# EAGLE design Transmitter+Bug-BC547 (EAGLE 7.7.0)
Simple FM Transmitter with Electret Microphone, based on NPN Transistor
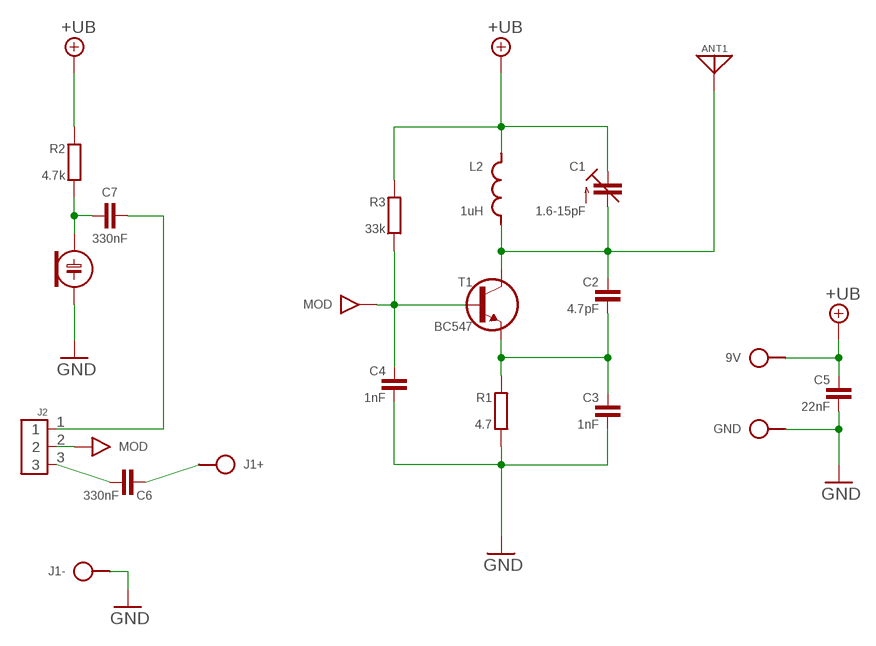
[diagram p0: schematic, sheet 1]

## Parts
9V  SPAD  [SPAD]
ANT1  ANT  [SPAD]
C1  1.6-15pF  C-TR-PH201272222-808-2PINB  [TRIM-2222-808]
C2  4.7pF  C025-015X024  [C025-015X024]
C3  1nF  C025-015X024  [C025-015X024]
C4  1nF  C050-020X036/V  [C050-020X036/V]
C5  22nF  C050-020X036/V  [C050-020X036/V]
C6  330nF  C-H050-020X044  [C050-020X044]
C7  330nF  C050-020X044  [C050-020X044]
ECM  ECM-4  [ECM-4]
GND  SPAD  [SPAD]
J1  SPAD+--+  [SPAD-+]
J2  CONN-3P-3P  [CONN-3P]
L2  1uH  L-SHORT04/7V-X  [L-04/7V-X]
R1  4.7  R0204/2V  [0204/2V]
R2  4.7k  R0202/7-V  [0202/7-V]
R3  33k  R0202/7-V  [0202/7-V]
T1  BC547  BC547CBE  [TO92-CBE]

## Nets
+UB: 9V.1 C1.3(E) C5.1 L2.2 R2.1 R3.1
GND: C3.2 C4.2 C5.2 ECM.2(-) GND.1 J1.1 R1.2
MOD: C4.1 J2.2 R3.2 T1.B
N$1: C6.2 J2.3
N$2: ANT1.1 C1.2(A) C2.1 L2.1 T1.C
N$3: C2.2 C3.1 R1.1 T1.E
N$4: C7.2 J2.1
N$5: C6.1 J1.2
N$6: C7.1 ECM.1(+) R2.2

## Library data of the parts
9V GND = pad:SPAD
ANT1 = pad:ANT
C1 = cap-trim:C-TR-PH20127
C2-C5 C7 = c:C: CAPACITOR, European symbol
C6 = c:C-H
ECM = ECM:ECM
J1 = pad:SPAD+-
J2 = pinconn:CONN-3P
L2 = l:L-SHORT
R1-R3 = r:R: RESISTOR, European symbol
T1 = t:BC547

## Net classes
0 default: width 0.61 mm

## Board
Simple FM Transmitter with Electret Microphone, based on NPN Transistor
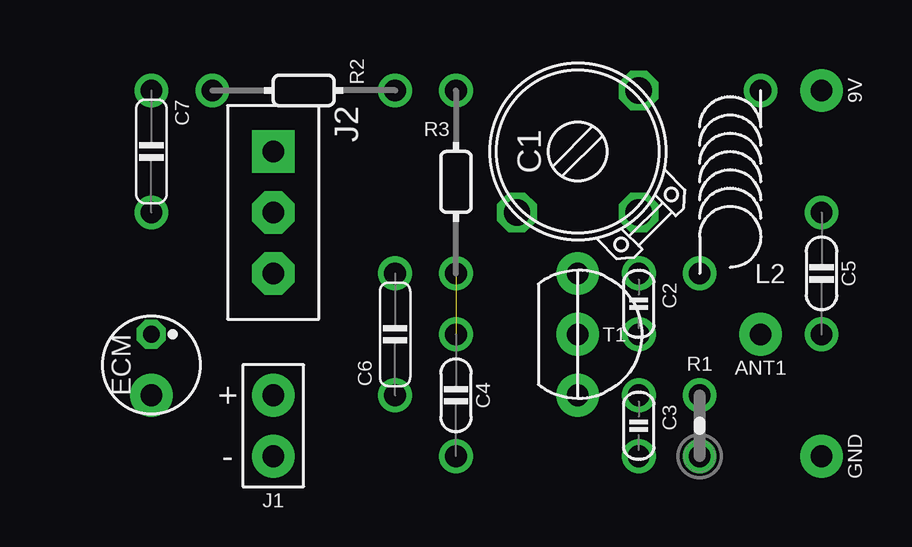
[diagram p1: board, top side]
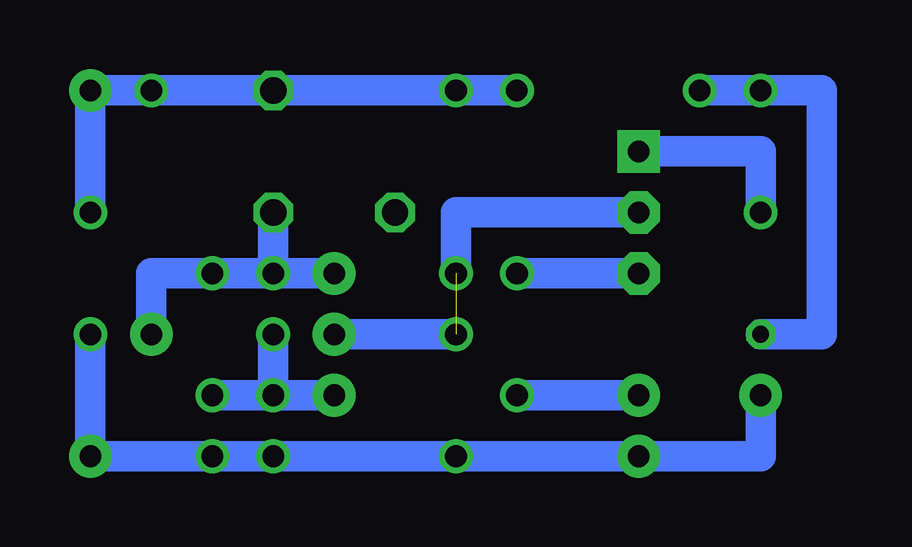
[diagram p2: board, bottom side, seen from below]

No outline drawn. Coordinates in mm, seen from the top.
Copper layers (1*16): Top 0.035mm / dielectric 1.5mm / Bottom 0.035mm
Design rules "default": minimum track width 10mil, minimum drill 24mil, track to track 8mil, track to pad 8mil, pad to pad 8mil, via to via 8mil, smd to smd 8mil, copper to edge 40mil, drill to drill 8mil, minimum pad ring 10mil, minimum via ring 8mil, stop-mask expansion 4mil, vias tented up to drill 0mil, thermal gap 10mil

### Footprints (pad centres in the part's own frame; a part is rotated, then mirrored left to right if it is on the bottom)
SPAD = drill 0.9 pad 1.778: 1 0,0
TRIM-2222-808 = drill 1.1 octagon: 1 -2.54,2.54; 2 -2.54,-2.54; 3 2.54,-2.54
C025-015X024 = drill 0.9: 1 -1.27,0; 2 1.27,0
C050-020X036/V = drill 0.9: 1 0,-2.54; 2 0,2.54
C050-020X044 = drill 0.9: 1 -2.54,0; 2 2.54,0
ECM-4 = drill 0.7 pad 1.2 octagon: 1 0,1.27 | drill 0.9 pad 1.778: 2 0,-1.27
SPAD-+ = drill 0.9 pad 1.778: 1 0,-1.27; 2 0,1.27
CONN-3P = drill 0.9 pad 1.778 square: 1 0,0 | drill 0.9 pad 1.778 octagon: 2 2.54,0; 3 5.08,0
L-04/7V-X = drill 0.9: 1 -1.27,-3.81; 2 1.27,3.81
0204/2V = drill 0.9: 1 0,1.27; 2 0,-1.27
0202/7-V = drill 0.9: 1 0,3.81; 2 0,-3.81
TO92-CBE = drill 0.9 pad 1.778: B 0,0; C 0,2.54; E 0,-2.54

### Placement (x,y rotation side)
9V  30.48,17.78 180 top
ANT1  27.94,7.62 90 top
C1  20.32,15.24 90 top
C2  22.86,8.89 270 top
C3  22.86,3.81 270 top
C4  15.24,5.08 180 top
C5  30.48,10.16 180 top
C6  12.7,7.62 90 top
C7  2.54,15.24 270 top
ECM  2.54,6.35 0 top
GND  30.48,2.54 180 top
J1  7.62,3.81 0 top
J2  7.62,15.24 270 top
L2  26.67,13.97 0 top
R1  25.4,3.81 0 top
R2  8.89,17.78 270 top
R3  15.24,13.97 0 top
T1  20.32,7.62 0 top

### Tracks (layer width: path | path; a pad name or v marks a point on that pad's centre or on a via)
+UB
  Bottom 1.27: C5.1 9V.1 C1.3 L2.2 R3.1 R2.1
GND
  Bottom 1.27: ECM.2 2.54,3.81 2.54,2.54 J1.1 C4.2 GND.1 | C5.2 GND.1 | C3.2 GND.1 | GND.1 R1.2
MOD  (1 unrouted)
  Bottom 1.27: T1.B C4.1 | R3.2 15.24,12.7 J2.2
N$1
  Bottom 1.27: C6.2 J2.3
N$2
  Bottom 1.27: L2.1 T1.C C2.1 | C2.1 C1.2 | ANT1.1 27.94,10.16 L2.1 | L2.1 C2.1
N$3
  Bottom 1.27: R1.1 C3.1 | C3.1 C2.2 | T1.E C3.1
N$4
  Bottom 1.27: J2.1 2.54,15.24 C7.2
N$5
  Bottom 1.27: J1.2 C6.1
N$6
  Bottom 1.27: R2.2 C7.1 0,17.78 0,7.62 ECM.1